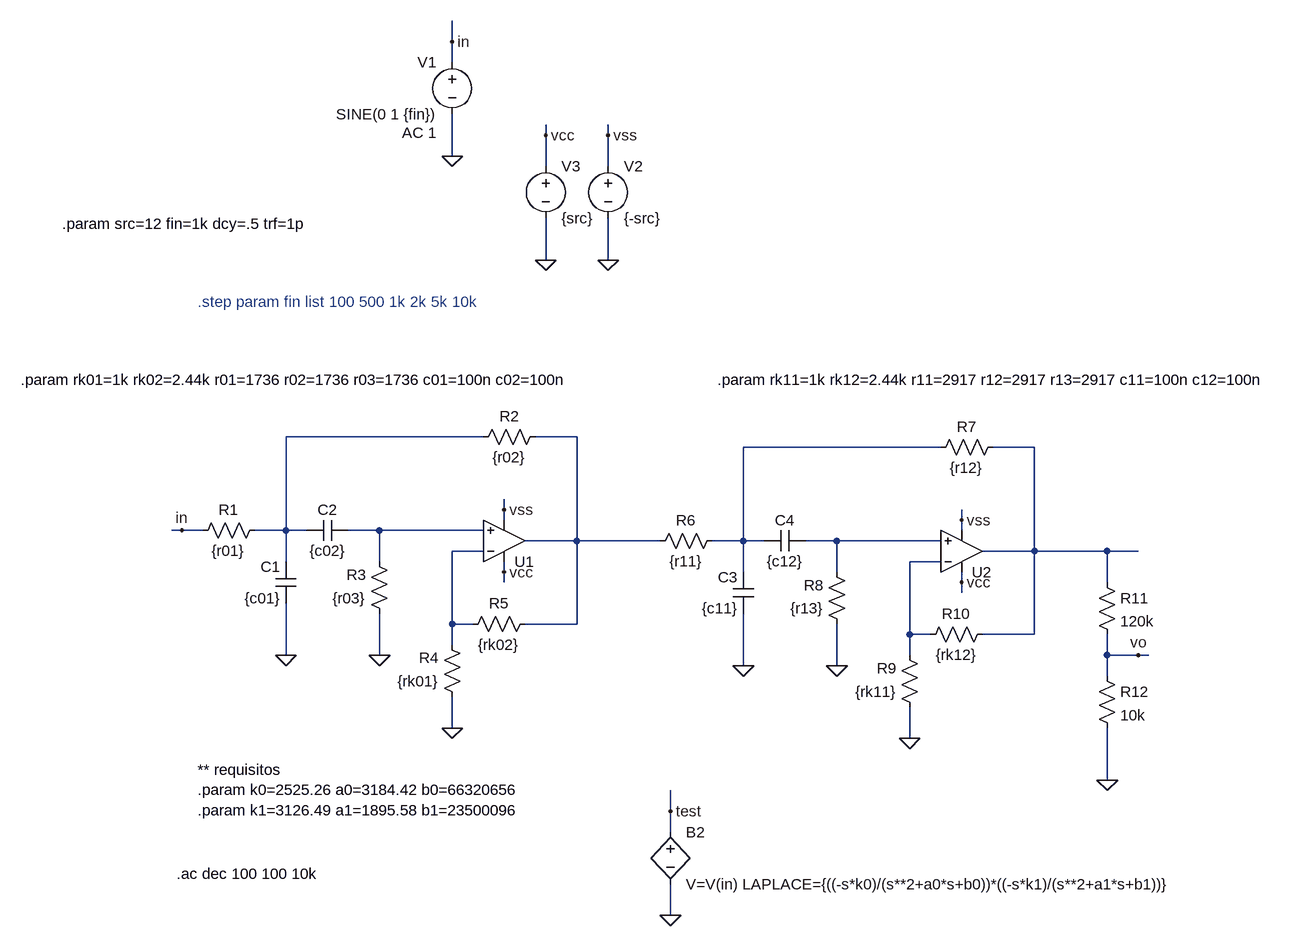
[diagram p0: schematic sallenKeyBP.asc]
sallenKeyBP.asc, the LTspice schematic file:
Version 4
SHEET 1 1684 1192
WIRE -656 -192 -656 -224
WIRE -656 -160 -656 -192
WIRE -512 -48 -512 -64
WIRE -416 -48 -416 -64
WIRE -656 -16 -656 -80
WIRE -512 0 -512 -48
WIRE -416 0 -416 -48
WIRE -512 144 -512 80
WIRE -416 144 -416 80
WIRE -608 416 -912 416
WIRE -464 416 -528 416
WIRE 96 432 -208 432
WIRE 240 432 176 432
WIRE -576 528 -576 512
WIRE -576 544 -576 528
WIRE 128 544 128 528
WIRE -1072 560 -1088 560
WIRE -1040 560 -1072 560
WIRE -912 560 -912 416
WIRE -912 560 -960 560
WIRE -880 560 -912 560
WIRE -768 560 -816 560
WIRE -608 560 -768 560
WIRE 128 560 128 544
WIRE -464 576 -464 416
WIRE -464 576 -544 576
WIRE -336 576 -464 576
WIRE -208 576 -208 432
WIRE -208 576 -256 576
WIRE -176 576 -208 576
WIRE -64 576 -112 576
WIRE 96 576 -64 576
WIRE -608 592 -656 592
WIRE 240 592 240 432
WIRE 240 592 160 592
WIRE 352 592 240 592
WIRE 400 592 352 592
WIRE -912 608 -912 560
WIRE -768 608 -768 560
WIRE 96 608 48 608
WIRE -576 624 -576 608
WIRE -208 624 -208 576
WIRE -64 624 -64 576
WIRE -576 640 -576 624
WIRE 128 640 128 624
WIRE 352 640 352 592
WIRE 128 656 128 640
WIRE -656 704 -656 592
WIRE -624 704 -656 704
WIRE -464 704 -464 576
WIRE -464 704 -544 704
WIRE 48 720 48 608
WIRE 80 720 48 720
WIRE 240 720 240 592
WIRE 240 720 160 720
WIRE -656 736 -656 704
WIRE -912 752 -912 672
WIRE -768 752 -768 688
WIRE 48 752 48 720
WIRE 352 752 352 720
WIRE 400 752 352 752
WIRE 416 752 400 752
WIRE -208 768 -208 688
WIRE -64 768 -64 704
WIRE 352 784 352 752
WIRE -656 864 -656 816
WIRE 48 880 48 832
WIRE 352 944 352 864
WIRE -320 992 -320 960
WIRE -320 1024 -320 992
WIRE -320 1152 -320 1104
FLAG -576 624 vcc
FLAG -576 528 vss
FLAG -656 -16 0
FLAG -416 144 0
FLAG -512 144 0
FLAG -512 -48 vcc
FLAG -416 -48 vss
FLAG -656 -192 in
FLAG -656 864 0
FLAG -768 752 0
FLAG -912 752 0
FLAG -1072 560 in
FLAG -320 1152 0
FLAG -320 992 test
FLAG 128 640 vcc
FLAG 128 544 vss
FLAG 48 880 0
FLAG -64 768 0
FLAG -208 768 0
FLAG 400 752 vo
FLAG 352 944 0
SYMBOL OpAmps\\UniversalOpamp -576 576 M180
SYMATTR InstName U1
SYMBOL res -944 544 R90
WINDOW 0 0 56 VBottom 2
WINDOW 3 32 56 VTop 2
SYMATTR InstName R1
SYMATTR Value {r01}
SYMBOL res -512 400 R90
WINDOW 0 0 56 VBottom 2
WINDOW 3 32 56 VTop 2
SYMATTR InstName R2
SYMATTR Value {r02}
SYMBOL voltage -656 -176 M0
WINDOW 123 24 124 Left 2
WINDOW 39 0 0 Left 0
SYMATTR Value2 AC 1
SYMATTR InstName V1
SYMATTR Value SINE(0 1 {fin})
SYMBOL voltage -416 -16 R0
WINDOW 123 0 0 Left 0
WINDOW 39 0 0 Left 0
SYMATTR InstName V2
SYMATTR Value {-src}
SYMBOL voltage -512 -16 R0
WINDOW 123 0 0 Left 0
WINDOW 39 0 0 Left 0
SYMATTR InstName V3
SYMATTR Value {src}
SYMBOL cap -896 672 R180
WINDOW 0 24 56 Left 2
WINDOW 3 24 8 Left 2
SYMATTR InstName C1
SYMATTR Value {c01}
SYMBOL cap -816 544 R90
WINDOW 0 0 32 VBottom 2
WINDOW 3 32 32 VTop 2
SYMATTR InstName C2
SYMATTR Value {c02}
SYMBOL res -752 704 R180
WINDOW 0 36 76 Left 2
WINDOW 3 36 40 Left 2
SYMATTR InstName R3
SYMATTR Value {r03}
SYMBOL res -640 832 R180
WINDOW 0 36 76 Left 2
WINDOW 3 36 40 Left 2
SYMATTR InstName R4
SYMATTR Value {rk01}
SYMBOL res -640 720 R270
WINDOW 0 32 56 VTop 2
WINDOW 3 0 56 VBottom 2
SYMATTR InstName R5
SYMATTR Value {rk02}
SYMBOL bv -320 1008 R0
SYMATTR InstName B2
SYMATTR Value V=V(in) LAPLACE={((-s*k0)/(s**2+a0*s+b0))*((-s*k1)/(s**2+a1*s+b1))}
SYMBOL OpAmps\\UniversalOpamp 128 592 M180
SYMATTR InstName U2
SYMBOL res -240 560 R90
WINDOW 0 0 56 VBottom 2
WINDOW 3 32 56 VTop 2
SYMATTR InstName R6
SYMATTR Value {r11}
SYMBOL res 192 416 R90
WINDOW 0 0 56 VBottom 2
WINDOW 3 32 56 VTop 2
SYMATTR InstName R7
SYMATTR Value {r12}
SYMBOL cap -192 688 R180
WINDOW 0 24 56 Left 2
WINDOW 3 24 8 Left 2
SYMATTR InstName C3
SYMATTR Value {c11}
SYMBOL cap -112 560 R90
WINDOW 0 0 32 VBottom 2
WINDOW 3 32 32 VTop 2
SYMATTR InstName C4
SYMATTR Value {c12}
SYMBOL res -48 720 R180
WINDOW 0 36 76 Left 2
WINDOW 3 36 40 Left 2
SYMATTR InstName R8
SYMATTR Value {r13}
SYMBOL res 64 848 R180
WINDOW 0 36 76 Left 2
WINDOW 3 36 40 Left 2
SYMATTR InstName R9
SYMATTR Value {rk11}
SYMBOL res 64 736 R270
WINDOW 0 32 56 VTop 2
WINDOW 3 0 56 VBottom 2
SYMATTR InstName R10
SYMATTR Value {rk12}
SYMBOL res 336 624 R0
SYMATTR InstName R11
SYMATTR Value 120k
SYMBOL res 336 768 R0
SYMATTR InstName R12
SYMATTR Value 10k
TEXT -1080 1088 Left 2 !.ac dec 100 100 10k
TEXT -1320 328 Left 2 !.param rk01=1k rk02=2.44k r01=1736 r02=1736 r03=1736 c01=100n c02=100n
TEXT -1256 88 Left 2 !.param src=12 fin=1k dcy=.5 trf=1p
TEXT -1048 928 Left 2 !** requisitos\n.param k0=2525.26 a0=3184.42 b0=66320656\n.param k1=3126.49 a1=1895.58 b1=23500096
TEXT -248 328 Left 2 !.param rk11=1k rk12=2.44k r11=2917 r12=2917 r13=2917 c11=100n c12=100n
TEXT -1048 208 Left 2 ;.step param fin list 100 500 1k 2k 5k 10k

The netlist it stands for:
* sallenKeyBP.asc
XU1 N005 N007 vcc vss N002 level1 Avol=1Meg GBW=10Meg Vos=0 En=0 Enk=0 In=0 Ink=0 Rin=500Meg  ; pins In+ In- V+ V- OUT
R1 N001 in {r01}
R2 N002 N001 {r02}
V1 in 0 SINE(0 1 {fin}) AC 1
V2 vss 0 {-src}
V3 vcc 0 {src}
C1 0 N001 {c01}
C2 N005 N001 {c02}
R3 0 N005 {r03}
R4 0 N007 {rk01}
R5 N007 N002 {rk02}
B2 test 0 V=V(in) LAPLACE={((-s*k0)/(s**2+a0*s+b0))*((-s*k1)/(s**2+a1*s+b1))}
XU2 N006 N008 vcc vss N004 level1 Avol=1Meg GBW=10Meg Vos=0 En=0 Enk=0 In=0 Ink=0 Rin=500Meg  ; pins In+ In- V+ V- OUT
R6 N003 N002 {r11}
R7 N004 N003 {r12}
C3 0 N003 {c11}
C4 N006 N003 {c12}
R8 0 N006 {r13}
R9 0 N008 {rk11}
R10 N008 N004 {rk12}
R11 N004 vo 120k
R12 vo 0 10k
.ac dec 100 100 10k
.param rk01=1k rk02=2.44k r01=1736 r02=1736 r03=1736 c01=100n c02=100n
.param src=12 fin=1k dcy=.5 trf=1p
** requisitos
.param k0=2525.26 a0=3184.42 b0=66320656
.param k1=3126.49 a1=1895.58 b1=23500096
.param rk11=1k rk12=2.44k r11=2917 r12=2917 r13=2917 c11=100n c12=100n
* .step param fin list 100 500 1k 2k 5k 10k
.lib UniversalOpAmp1.lib
.backanno
.end

* Results of the author's LTspice run, read from the files saved beside the schematic
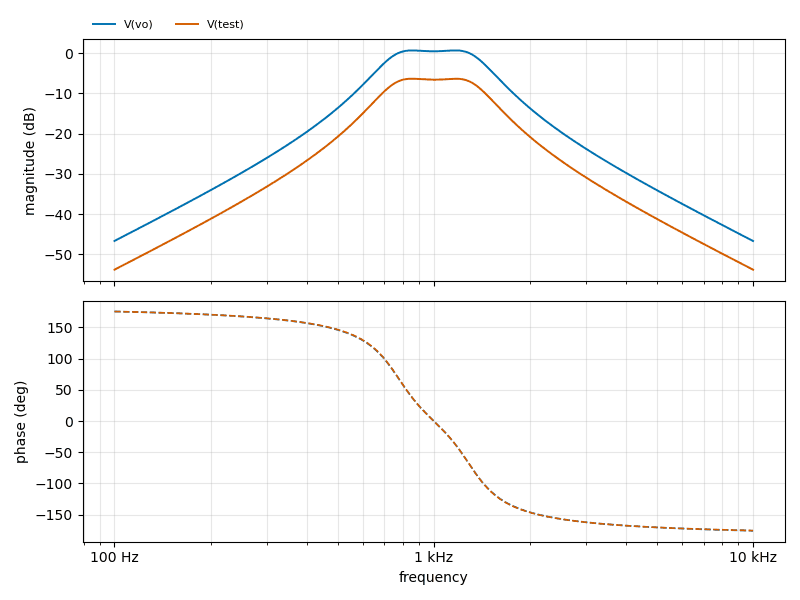
[diagram p1: AC Analysis of sallenKeyBP.asc, plotted from the saved traces]
* AC Analysis, 1 run:
*   V(vo): -46.66 dB at 100 Hz, -46.67 dB at 10 kHz, peak 0.67 dB at 1.175 kHz, 3 dB below the peak at 702.9 Hz and 1.422 kHz
*   V(test): -53.80 dB at 100 Hz, -53.80 dB at 10 kHz, peak -6.36 dB at 1.175 kHz, 3 dB below the peak at 703.2 Hz and 1.422 kHz